# EAGLE design ControlUnit_2 (EAGLE 8.5.2)
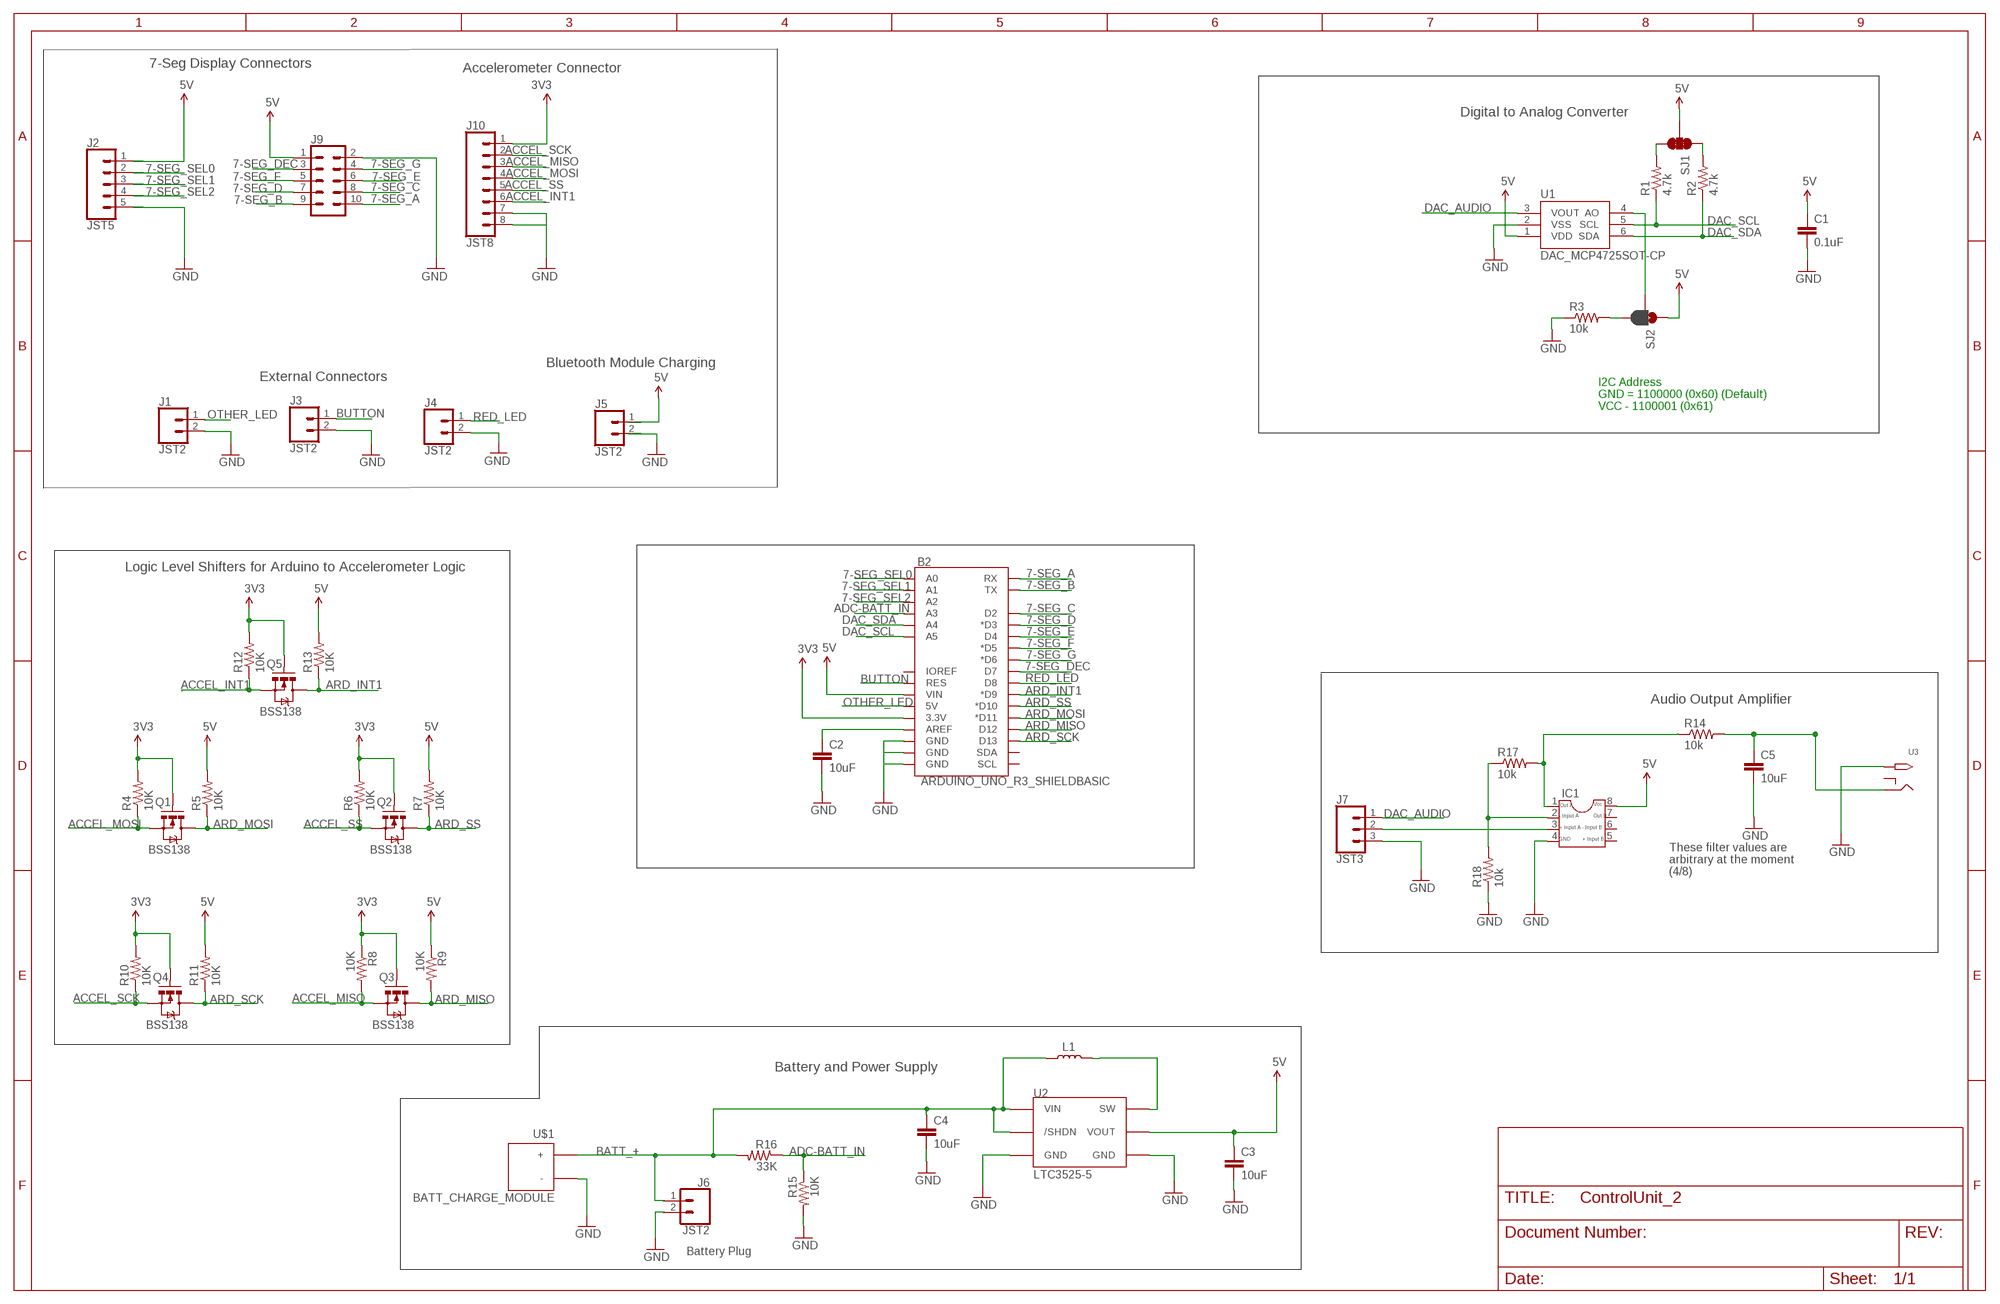
[diagram p0: schematic, sheet 1]

## Parts
B2  ARDUINO_UNO_R3_SHIELDBASIC  [UNO_R3_SHIELD]
C1  0.1uF  CAP0603-CAP  [0603-CAP]
C2  10uF  SPARKFUN_CAP0805  [SPARKFUN_0805]
C3  10uF  CAP0603-CAP  [0603-CAP]
C4  10uF  SPARKFUN_CAP0805  [SPARKFUN_0805]
C5  10uF  CAP0603-CAP  [0603-CAP]
IC1  DIL8  [DIL08]
J1  JST2  [2JST]
J2  JST5  [5JST]
J3  JST2  [2JST]
J4  JST2  [2JST]
J5  JST2  [2JST]
J6  JST2  [2JST]
J7  JST3  [3JST]
J9  CONN_05X2SHD_LOCK  [2X5-SHROUDED_LOCK]
J10  JST8  [8JST]
L1  10uH  INDUCTOR  [1210]
Q1  BSS138  MOSFET-NCHANNELSMD  [SOT23-3]
Q2  BSS138  MOSFET-NCHANNELSMD  [SOT23-3]
Q3  BSS138  MOSFET-NCHANNELSMD  [SOT23-3]
Q4  BSS138  MOSFET-NCHANNELSMD  [SOT23-3]
Q5  BSS138  MOSFET-NCHANNELSMD  [SOT23-3]
R1  4.7k  RESISTOR0603-RES  [0603-RES]
R2  4.7k  RESISTOR0603-RES  [0603-RES]
R3  10k  RESISTOR0603-RES  [0603-RES]
R4  10K  SPARKFUN_RESISTOR0603-RES  [SPARKFUN_0603-RES]
R5  10K  SPARKFUN_RESISTOR0603-RES  [SPARKFUN_0603-RES]
R6  10K  SPARKFUN_RESISTOR0603-RES  [SPARKFUN_0603-RES]
R7  10K  SPARKFUN_RESISTOR0603-RES  [SPARKFUN_0603-RES]
R8  10K  RESISTOR0603-RES  [0603-RES]
R9  10K  RESISTOR0603-RES  [0603-RES]
R10  10K  SPARKFUN_RESISTOR0603-RES  [SPARKFUN_0603-RES]
R11  10K  SPARKFUN_RESISTOR0603-RES  [SPARKFUN_0603-RES]
R12  10K  SPARKFUN_RESISTOR0603-RES  [SPARKFUN_0603-RES]
R13  10K  SPARKFUN_RESISTOR0603-RES  [SPARKFUN_0603-RES]
R14  10k  RESISTOR0603-RES  [0603-RES]
R15  10K  RESISTOR0603-RES  [0603-RES]
R16  33K  RESISTOR0603-RES  [0603-RES]
R17  10k  RESISTOR0603-RES  [0603-RES]
R18  10k  RESISTOR0603-RES  [0603-RES]
SJ1  JUMPER-PAD-3-NC_BY_TRACE  [PAD-JUMPER-3-3OF3_NC_BY_TRACE_YES_SILK_FULL_BOX]
SJ2  JUMPER-PAD-3-2OF3_NC_BY_PASTE  [PAD-JUMPER-3-2OF3_NC_BY_PASTE_YES_SILK_FULL_BOX]
U1  DAC_MCP4725SOT-CP  [SOT23-6-MCP4725]
U2  LTC3525-5  [LTC3525-5]
U3  MONO_JACK  [MONO_JACK]
U$1  BATT_CHARGE_MODULE  [BATT_CHARGE_MODULE]

## Nets
3V3: B2.3.3V J10.1 Q1.1(G) Q2.1(G) Q3.1(G) Q4.1(G) Q5.1(G) R4.2 R6.2 R8.1 R10.2 R12.2
5V: B2.VIN C1.1 C3.1 IC1.8 J2.1 J5.1 J9.1 R5.2 R7.2 R9.1 R11.2 R13.2 SJ1.2 SJ2.1 U1.1(VDD) U2.4(VOUT)
7-SEG_A: B2.RX J9.10
7-SEG_B: B2.TX J9.9
7-SEG_C: B2.D2 J9.8
7-SEG_D: B2.D3(*D3) J9.7
7-SEG_DEC: B2.D7 J9.3
7-SEG_E: B2.D4 J9.6
7-SEG_F: B2.D5(*D5) J9.5
7-SEG_G: B2.D6(*D6) J9.4
7-SEG_SEL0: B2.A0 J2.2
7-SEG_SEL1: B2.A1 J2.3
7-SEG_SEL2: B2.A2 J2.4
ACCEL_INT1: J10.6 Q5.2(S) R12.1
ACCEL_MISO: J10.3 Q3.2(S) R8.2
ACCEL_MOSI: J10.4 Q1.2(S) R4.1
ACCEL_SCK: J10.2 Q4.2(S) R10.1
ACCEL_SS: J10.5 Q2.2(S) R6.1
ADC-BATT_IN: B2.A3 R15.1 R16.1
ARD_INT1: B2.D9(*D9) Q5.3(D) R13.1
ARD_MISO: B2.D12 Q3.3(D) R9.2
ARD_MOSI: B2.D11(*D11) Q1.3(D) R5.1
ARD_SCK: B2.D13 Q4.3(D) R11.1
ARD_SS: B2.D10(*D10) Q2.3(D) R7.1
BATT_+: C4.1 J6.1 L1.1 R16.2 U2.1(/SHDN) U2.3(VIN) U$1.P$2(+)
BUTTON: B2.RES J3.1
DAC_AUDIO: J7.1 U1.3(VOUT)
DAC_SCL: B2.A5 R1.1 U1.5(SCL)
DAC_SDA: B2.A4 R2.1 U1.6(SDA)
GND: B2.GND@0(GND) B2.GND@1(GND) B2.GND@2(GND) C1.2 C2.2 C3.2 C4.2 C5.2 IC1.4 J1.2 J2.5 J3.2 J4.2 J5.2 J6.2 J7.3 J9.2 J10.7 J10.8 R3.1 R15.2 R18.1 U1.2(VSS) U2.2(GND) U2.5(GND) U3.1 U$1.P$1(-)
N$1: R2.2 SJ1.1
N$2: R1.2 SJ1.3
N$3: SJ2.2 U1.4(AO)
N$4: R3.2 SJ2.3
N$5: IC1.1 R14.1 R17.2
N$6: L1.2 U2.6(SW)
N$7: C5.1 R14.2 U3.2
N$8: IC1.3 J7.2
N$10: B2.AREF C2.1
N$11: IC1.2 R17.1 R18.2
OTHER_LED: B2.5V J1.1
RED_LED: B2.D8 J4.1
Unconnected: B2.IOREF B2.SCL B2.SDA IC1.5 IC1.6 IC1.7 U3.3

## Notes on the sheet
- 7-Seg Display Connectors
- Accelerometer Connector
- Digital to Analog Converter
- Bluetooth Module Charging
- External Connectors
- I2C Address
  GND = 1100000 (0x60) (Default)
  VCC - 1100001 (0x61)
- Logic Level Shifters for Arduino to Accelerometer Logic
- Audio Output Amplifier
- These filter values are 
  arbitrary at the moment
  (4/8)
- Battery and Power Supply
- Battery Plug

## Library data of the parts
B2 = Beehive:ARDUINO_UNO_R3_SHIELD: Arduino R3 Shield Footprint Shield form compatible with the Arduino Uno R3. SparkFun Products: MG2639 Cellular Shield <https://www.sparkfun.com/products/13120> MIDI Shield <https://www.sparkfun.com/products/12898> R3 Stackable Headers Kit <https://www.sparkfun.com/products/11417>
C1 C3 C5 = SparkFun:CAP: Capacitor Standard 0603 ceramic capacitor, and 0.1" leaded capacitor.
C2 C4 = ControlUnit:SPARKFUN_CAP: Capacitor Standard 0603 ceramic capacitor, and 0.1" leaded capacitor.
IC1 = Beehive:DIL8: Dual In Line / Socket
J1 J3-J6 = ControlUnit:JST2
J2 = ControlUnit:JST5
J7 = ControlUnit:JST3
J9 = SparkFun-Connectors:CONN_05X2: Multi connection point. Often used as Generic Header-pin footprint for 0.1 inch spaced/style header connections For AVR SPI programming port, see special device with nice symbol: "AVR_SPI_PROG_5x2.dev" You can populate with any combo of single row headers, but if you'd like an exact match, check these: 2x5 AVR ICSP Male Header <https://www.sparkfun.com/products/778> (PRT-00778) 2x5 Pin Shrouded Header <https://www.sparkfun.com/products/8506> (PRT-08506) On any of the 0.1 inch spaced packages, you can populate with these: Break Away Headers - Straight <https://www.sparkfun.com/products/116> (PRT-00116) Break Away Male Headers - Right Angle <https://www.sparkfun.com/products/553> (PRT-00553) Female Headers <https://www.sparkfun.com/products/115> (PRT-00115) Break Away Headers - Machine Pin <https://www.sparkfun.com/products/117> (PRT-00117) Break Away Female Headers - Swiss Machine Pin <https://www.sparkfun.com/products/743> (PRT-00743) Special note: the shrouded connector mates well with our 5x2 ribbon cables: 2x5 Pin IDC Ribbon Cable <https://www.sparkfun.com/products/8535> (PRT-08535); PROD_ID: CONN-08671; SF_ID: PRT-08506
J10 = ControlUnit:JST8
L1 = Beehive:INDUCTOR
Q1-Q5 = SparkFun:MOSFET-NCHANNEL
R1-R3 R8 R9 R14-R18 = SparkFun:RESISTOR: Resistor Basic schematic elements and footprints for 0603, 1206, and PTH resistors.
R4-R7 R10-R13 = ControlUnit:SPARKFUN_RESISTOR: Resistor Basic schematic elements and footprints for 0603, 1206, and PTH resistors.
SJ1 = SparkFun-Passives:JUMPER-PAD-3-NC_BY_TRACE
SJ2 = SparkFun-Passives:JUMPER-PAD-3-2OF3_NC_BY_PASTE
U1 = SparkFun-AnalogIC:DAC_MCP4725: Microchip 12-bit I2C DAC, SOT23-6
U2 = Beehive:LTC3525-5
U3 = Beehive:MONO_JACK; DIST: Tekbots; DIST#: Tekbots; MANF: CUI Inc.; MANF#: MJ-3536NG
U$1 = Beehive:BATT_CHARGE_MODULE

## Board
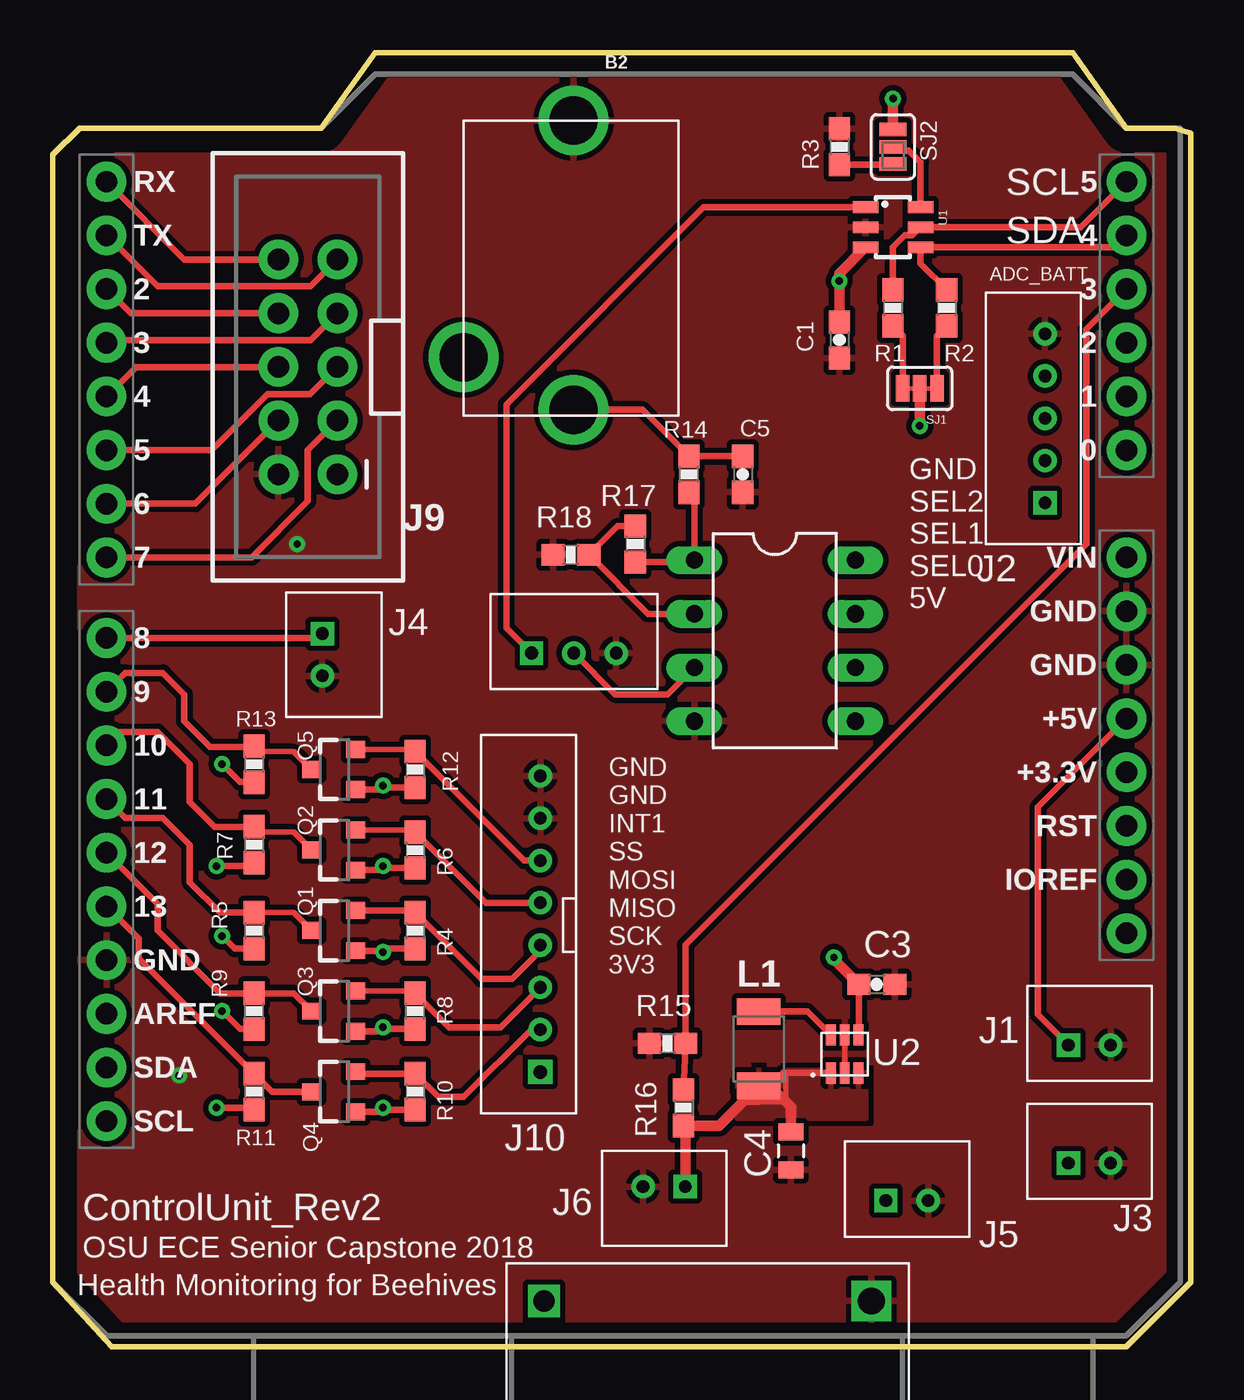
[diagram p1: board, top side]
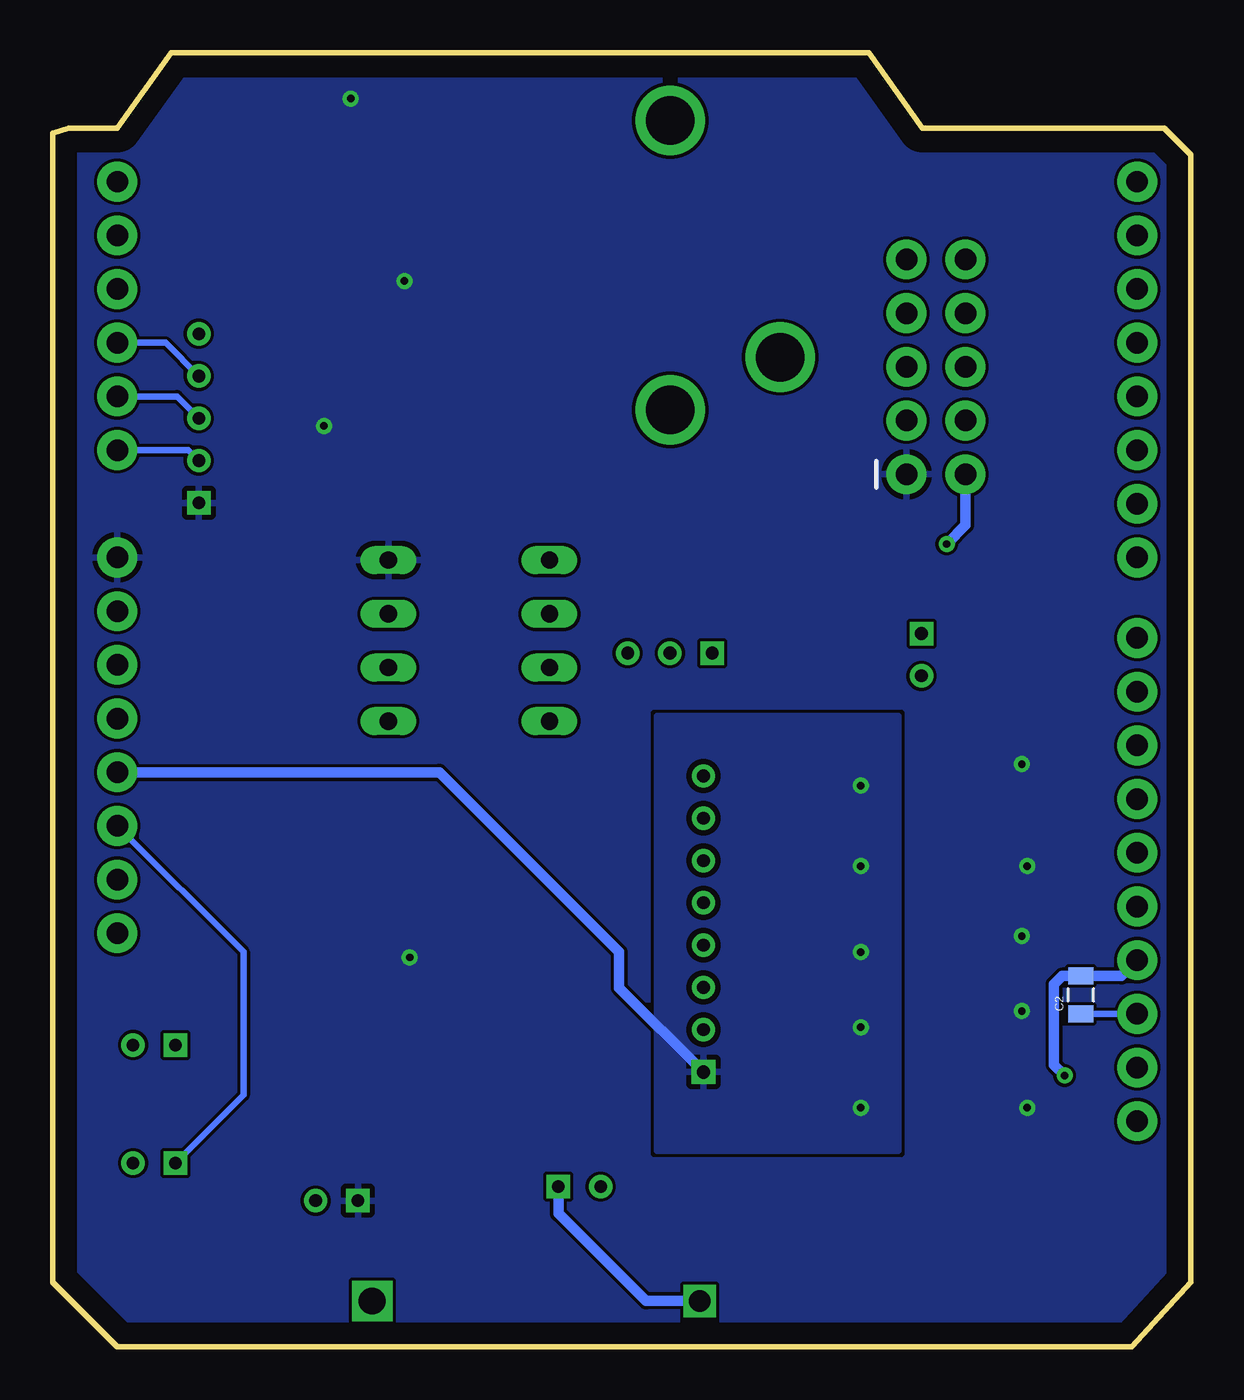
[diagram p2: board, bottom side, seen from below]

Size 53.85 x 61.21 mm. Coordinates in mm from the lower left corner, seen from the top.
Outline: 1.27,57.66 0,56.39 0,3.05 2.79,0 50.8,0 53.85,3.05 53.85,57.4 53.09,57.66 50.8,57.66 48.26,61.21 15.24,61.21 12.7,57.66 1.27,57.66
Copper layers (1*16): Top 0.035mm / dielectric 1.5mm / Bottom 0.035mm
Design rules "default": minimum track width 6mil, minimum drill 0.35mm, track to track 6mil, track to pad 6mil, pad to pad 6mil, via to via 6mil, smd to smd 6mil, copper to edge 40mil, drill to drill 6mil, minimum pad ring 10mil, minimum via ring 8mil, stop-mask expansion 4mil, vias tented up to drill 0mil, thermal gap 10mil

### Footprints (pad centres in the part's own frame; a part is rotated, then mirrored left to right if it is on the bottom)
UNO_R3_SHIELD = drill 1.016 pad 1.88: 3.3V 24.13,-2.54; 5V 24.13,0; A0 24.13,12.7; A1 24.13,15.24; A2 24.13,17.78; A3 24.13,20.32; A4 24.13,22.86; A5 24.13,25.4; AREF -24.13,-13.97; D2 -24.13,20.32; D3 -24.13,17.78; D4 -24.13,15.24; D5 -24.13,12.7; D6 -24.13,10.16; D7 -24.13,7.62; D8 -24.13,3.81; D9 -24.13,1.27; D10 -24.13,-1.27; D11 -24.13,-3.81; D12 -24.13,-6.35; D13 -24.13,-8.89; GND@0 24.13,2.54; GND@1 24.13,5.08; GND@2 -24.13,-11.43; IOREF 24.13,-7.62; NC 24.13,-10.16; RES 24.13,-5.08; RX -24.13,25.4; SCL -24.13,-19.05; SDA -24.13,-16.51; TX -24.13,22.86; VIN 24.13,7.62
0603-CAP = smd 1.1 x 1: 1 -0.85,0; 2 0.85,0
SPARKFUN_0805 = smd 0.8 x 1.2: 1 -0.9,0; 2 0.9,0
DIL08 = drill 0.813 long: 1 -3.81,-3.81; 2 -1.27,-3.81; 3 1.27,-3.81; 4 3.81,-3.81; 5 3.81,3.81; 6 1.27,3.81; 7 -1.27,3.81; 8 -3.81,3.81
2JST = drill 0.6 square: 1 1.95,1.7 | drill 0.6: 2 3.95,1.7
5JST = drill 0.6 square: 1 1.95,1.7 | drill 0.6: 2 3.95,1.7; 3 5.95,1.7; 4 7.95,1.7; 5 9.95,1.7
3JST = drill 0.6 square: 1 1.95,1.7 | drill 0.6: 2 3.95,1.7; 3 5.95,1.7
2X5-SHROUDED_LOCK = drill 1.016 pad 1.88: 1 -1.397,5.08; 2 1.397,5.08; 3 -1.397,2.54; 4 1.397,2.54; 5 -1.397,0; 6 1.397,0; 7 -1.397,-2.54; 8 1.397,-2.54; 9 -1.397,-5.08; 10 1.397,-5.08
8JST = drill 0.635 square: 1 1.95,1.7 | drill 0.6: 2 3.95,1.7; 3 5.95,1.7; 4 7.95,1.7; 5 9.95,1.7; 6 11.95,1.7; 7 13.95,1.7; 8 15.95,1.7
1210 = smd 1.27 x 2.06: 1 -1.755,0; 2 1.755,0
SOT23-3 = smd 0.8 x 0.9: 1 -0.95,-1; 2 0.95,-1; 3 0,1.1
0603-RES = smd 1.1 x 1: 1 -0.85,0; 2 0.85,0
SPARKFUN_0603-RES = smd 1.1 x 1: 1 -0.85,0; 2 0.85,0
PAD-JUMPER-3-3OF3_NC_BY_TRACE_YES_SILK_FULL_BOX = smd 0.635 x 1.27: 1 -0.813,0; 2 0,0; 3 0.813,0
PAD-JUMPER-3-2OF3_NC_BY_PASTE_YES_SILK_FULL_BOX = smd 0.635 x 1.27: 1 -0.813,0; 2 0,0; 3 0.813,0
SOT23-6-MCP4725 = smd 0.55 x 1.2: 1 0.95,-1.3; 2 0,-1.3; 3 -0.95,-1.3; 4 -0.95,1.3; 5 0,1.3; 6 0.95,1.3
LTC3525-5 = smd 0.47 x 1: 1 -0.65,-0.9; 2 0,-0.9; 3 0.65,-0.9; 4 0.65,0.9; 5 0,0.9; 6 -0.65,0.9
MONO_JACK = drill 2.286: 1 0,5.207; 2 13.691,5.207; 3 11.201,0
BATT_CHARGE_MODULE = drill 1.27 square: P$1 1.778,1.778 | drill 1.016 square: P$2 17.272,1.778

### Placement (x,y rotation side)
B2  26.67,29.72 0 top
C1  37.21,47.62 270 top
C2  5.21,16.64 90 bottom
C3  38.99,17.14 0 top
C4  34.93,9.27 270 top
C5  32.64,41.27 270 top
IC1  34.16,33.4 270 top
J1  46.1,12.57 0 top
J2  48.64,37.97 90 top
J3  46.1,6.98 0 top
J4  11.05,35.69 270 top
J5  37.47,5.21 0 top
J6  31.88,9.27 180 top
J7  20.7,31.12 0 top
J9  12.07,46.36 180 top
J10  24.77,11.05 90 top
L1  33.4,14.1 90 top
Q1  13.34,19.68 90 top
Q2  13.34,23.49 90 top
Q3  13.34,15.88 90 top
Q4  13.34,12.06 90 top
Q5  13.34,27.3 90 top
R1  39.75,49.15 270 top
R2  42.29,49.15 270 top
R3  37.21,56.77 270 top
R4  17.14,19.68 270 top
R5  9.52,19.68 270 top
R6  17.14,23.49 270 top
R7  9.52,23.75 270 top
R8  17.14,15.88 90 top
R9  9.52,15.88 90 top
R10  17.14,12.06 270 top
R11  9.52,12.06 270 top
R12  17.14,27.3 270 top
R13  9.52,27.56 270 top
R14  30.1,41.27 90 top
R15  29.08,14.35 180 top
R16  29.84,11.3 270 top
R17  27.56,37.97 270 top
R18  24.51,37.46 0 top
SJ1  41.02,45.34 180 top
SJ2  39.75,56.77 270 top
U1  39.75,52.96 270 top
U2  37.47,13.84 0 top
U3  19.43,58.01 270 top
U$1  40.51,3.94 180 top

### Tracks (layer width: path | path; a pad name or v marks a point on that pad's centre or on a via)
3V3  (via drill 0.35)
  Top 0.305: Q3.1 15.3,14.92 v15.62,15.11 15.71,15.02 R8.1 | Q1.1 15.55,18.73 v15.62,18.67 15.79,18.84 R4.2 | Q2.1 15.43,22.55 v15.62,22.73 15.71,22.64 R6.2 | Q5.1 15.43,26.35 v15.62,26.54 15.71,26.45 R12.2 | Q4.1 15.43,11.11 v15.62,11.3 15.71,11.21 R10.2
  Bottom 0.508: B2.3.3V 35.56,27.18 27.05,18.67 27.05,16.98 J10.1
  pour Bottom (isolate 0.254): 13.84,29.84 13.84,9.27 25.27,9.27 25.27,29.84
5V  (via drill 0.35)
  Top 0.305: R11.2 9.44,11.3 v7.75,11.3 | v8,15.88 8.85,15.02 R9.1 | v8,19.43 8.6,18.84 R5.2 | v7.75,22.73 9.36,22.73 R7.2 | v8,27.56 8.85,26.71 R13.2 | U2.4 38.14,14.77 C3.1
  Top 0.508: SJ2.1 v39.75,59.05 | C1.1 v37.21,50.42 37.21,50.77 U1.1 | SJ1.2 v41.02,43.56 | C3.1 36.96,18.33 v36.96,18.41
  pour Bottom (rank 2): -1.14,-0.89 -1.14,60.58 54.23,60.58 54.23,-0.89
7-SEG_A
  Top 0.305: J9.10 6.22,51.44 B2.RX
7-SEG_B
  Top 0.305: J9.9 12.19,50.16 4.95,50.16 B2.TX
7-SEG_C
  Top 0.305: J9.8 3.68,48.89 B2.D2
7-SEG_D
  Top 0.305: J9.7 12.19,47.62 2.67,47.62 B2.D3
7-SEG_DEC
  Top 0.305: J9.3 12.07,42.42 12.07,40 9.4,37.34 B2.D7
7-SEG_E
  Top 0.305: J9.6 3.94,46.36 B2.D4
7-SEG_F
  Top 0.305: J9.5 12.17,45.06 10.15,45.06 7.51,42.42 B2.D5
7-SEG_G
  Top 0.305: J9.4 6.73,39.88 B2.D6
7-SEG_SEL0
  Bottom 0.305: B2.A0 47.44,42.42 J2.2
7-SEG_SEL1
  Bottom 0.305: B2.A1 47.98,44.96 J2.3
7-SEG_SEL2
  Bottom 0.305: B2.A2 48.52,47.5 J2.4
ACCEL_INT1
  Top 0.254: 14.44,28.16 Q5.2 17.05,28.25 R12.1
  Top 0.305: R12.1 22.3,23 J10.6
ACCEL_MISO
  Top 0.254: 17.31,16.89 R8.2 17.05,16.82 Q3.2
  Top 0.305: R8.2 18.76,15.11 21.18,15.11 J10.3
ACCEL_MOSI
  Top 0.305: Q1.2 17.05,20.63 R4.1 20.28,17.4 21.72,17.4 23.07,18.75 J10.4
ACCEL_SCK
  Top 0.305: Q4.2 14.44,12.91 R10.1 18.25,11.81 19.43,11.81 22.62,15 J10.2
ACCEL_SS
  Top 0.254: Q2.2 17.05,24.45 R6.1
  Top 0.305: R6.1 20.49,21 J10.5
ADC-BATT_IN
  Top 0.305: R16.1 29.92,14.1 | 29.92,14.1 R15.1 | B2.A3 48.9,48.13 48.9,37.97 29.92,19 29.92,14.1
ARD_INT1
  Top 0.254: Q5.3 11.39,28.16 9.78,28.16 9.57,28.37 R13.1
  Top 0.305: B2.D9 3.43,31.88 5.21,31.88 6.22,30.86 6.22,29.59 7.45,28.37 9.57,28.37
ARD_MISO
  Top 0.305: Q3.3 11.39,16.73 R9.2 7.91,16.73 4.95,19.68 4.95,20.95 B2.D12
ARD_MOSI
  Top 0.254: Q1.3 11.39,20.53 R5.1
  Top 0.305: B2.D11 3.43,25.02 5.21,25.02 6.48,23.75 6.48,21.97 7.91,20.53 R5.1
ARD_SCK
  Top 0.305: Q4.3 10.38,12.06 R11.1 4.06,18.38 4.06,19.3 B2.D13
ARD_SS
  Top 0.254: Q2.3 11.39,24.34 9.78,24.34 R7.1
  Top 0.305: R7.1 7.66,24.6 6.48,25.78 6.48,27.56 4.95,29.08 3.17,29.08 B2.D10
BATT_+
  Top 0.254: L1.1 33.4,11.58 | 32.63,11.57 33.4,11.57 33.4,11.58 | 33.4,11.58 34.69,11.58 34.69,12.7 34.29,12.7
  Top 0.305: U2.1 34.53,12.94 34.29,12.7 33.93,12.34 L1.1
  Top 0.508: 32.63,11.57 31.51,10.45 R16.2 29.93,10.37 J6.1 | C4.1 34.93,11.35 34.69,11.58 33.93,12.34
  Bottom 0.508: U$1.P$2 25.78,2.16 29.93,6.3 J6.1
  pour Top: 32.38,13.08 32.38,10.79 38.48,10.79 38.48,13.08
BUTTON
  Bottom 0.305: J3.1 44.83,11.9 44.83,18.67 B2.RES
DAC_AUDIO
  Top 0.305: J7.1 21.46,34 21.46,44.58 30.8,53.91 U1.3
DAC_SCL
  Top 0.305: R1.1 39.75,52.02 40.33,52.59 40.68,52.59 U1.5 48.64,52.96 B2.A5
DAC_SDA
  Top 0.305: B2.A4 50.23,52.01 U1.6 41.05,51.24 R2.1
GND  (via drill 0.35)
  Top 0.254: U2.2 U2.5
  Bottom 0.508: J9.2 10.67,38.86 v11.56,37.97 | B2.GND@2 3.29,17.54 C2.2 6.08,17.54 6.48,17.14 6.48,13.33 v5.97,12.83
  pour Top (isolate 0.254, rank 2): -1.14,60.33 -1.14,-0.89 53.72,-0.89 53.72,60.33
N$1
  Top 0.305: SJ1.1 41.83,47.84 R2.2
N$2
  Top 0.305: SJ1.3 40.21,47.84 R1.2
N$3
  Top 0.305: SJ2.2 39.94,56.58 40.51,56.58 41.05,56.04 U1.4
N$4
  Top 0.305: R3.2 39.71,55.92 SJ2.3
N$5
  Top 0.305: R17.2 30.27,37.12 IC1.1 30.35,40.17 R14.1
N$6
  Top 0.305: U2.6 35.71,15.85 L1.2
N$7
  Top 0.305: C5.1 R14.2 27.9,44.32 U3.2
N$8
  Top 0.305: J7.2 26.61,30.86 29.08,30.86 IC1.3
N$10
  Bottom 0.305: C2.1 2.55,15.74 B2.AREF
N$11
  Top 0.305: IC1.2 28.16,34.67 R18.2 26.72,38.82 R17.1
OTHER_LED
  Top 0.305: B2.5V 46.61,25.53 46.61,15.71 J1.1
RED_LED
  Top 0.305: B2.D8 12.54,33.53 J4.1

### Text on the board
tPlace: SCL | SDA | ADC_BATT | GND / SEL2 / SEL1 / SEL0 / 5V | GND / GND / INT1 / SS / MOSI / MISO / SCK / 3V3 | ControlUnit_Rev2 | OSU ECE Senior Capstone 2018 | Health Monitoring for Beehives